# EAGLE design power supply (EAGLE 6.3)
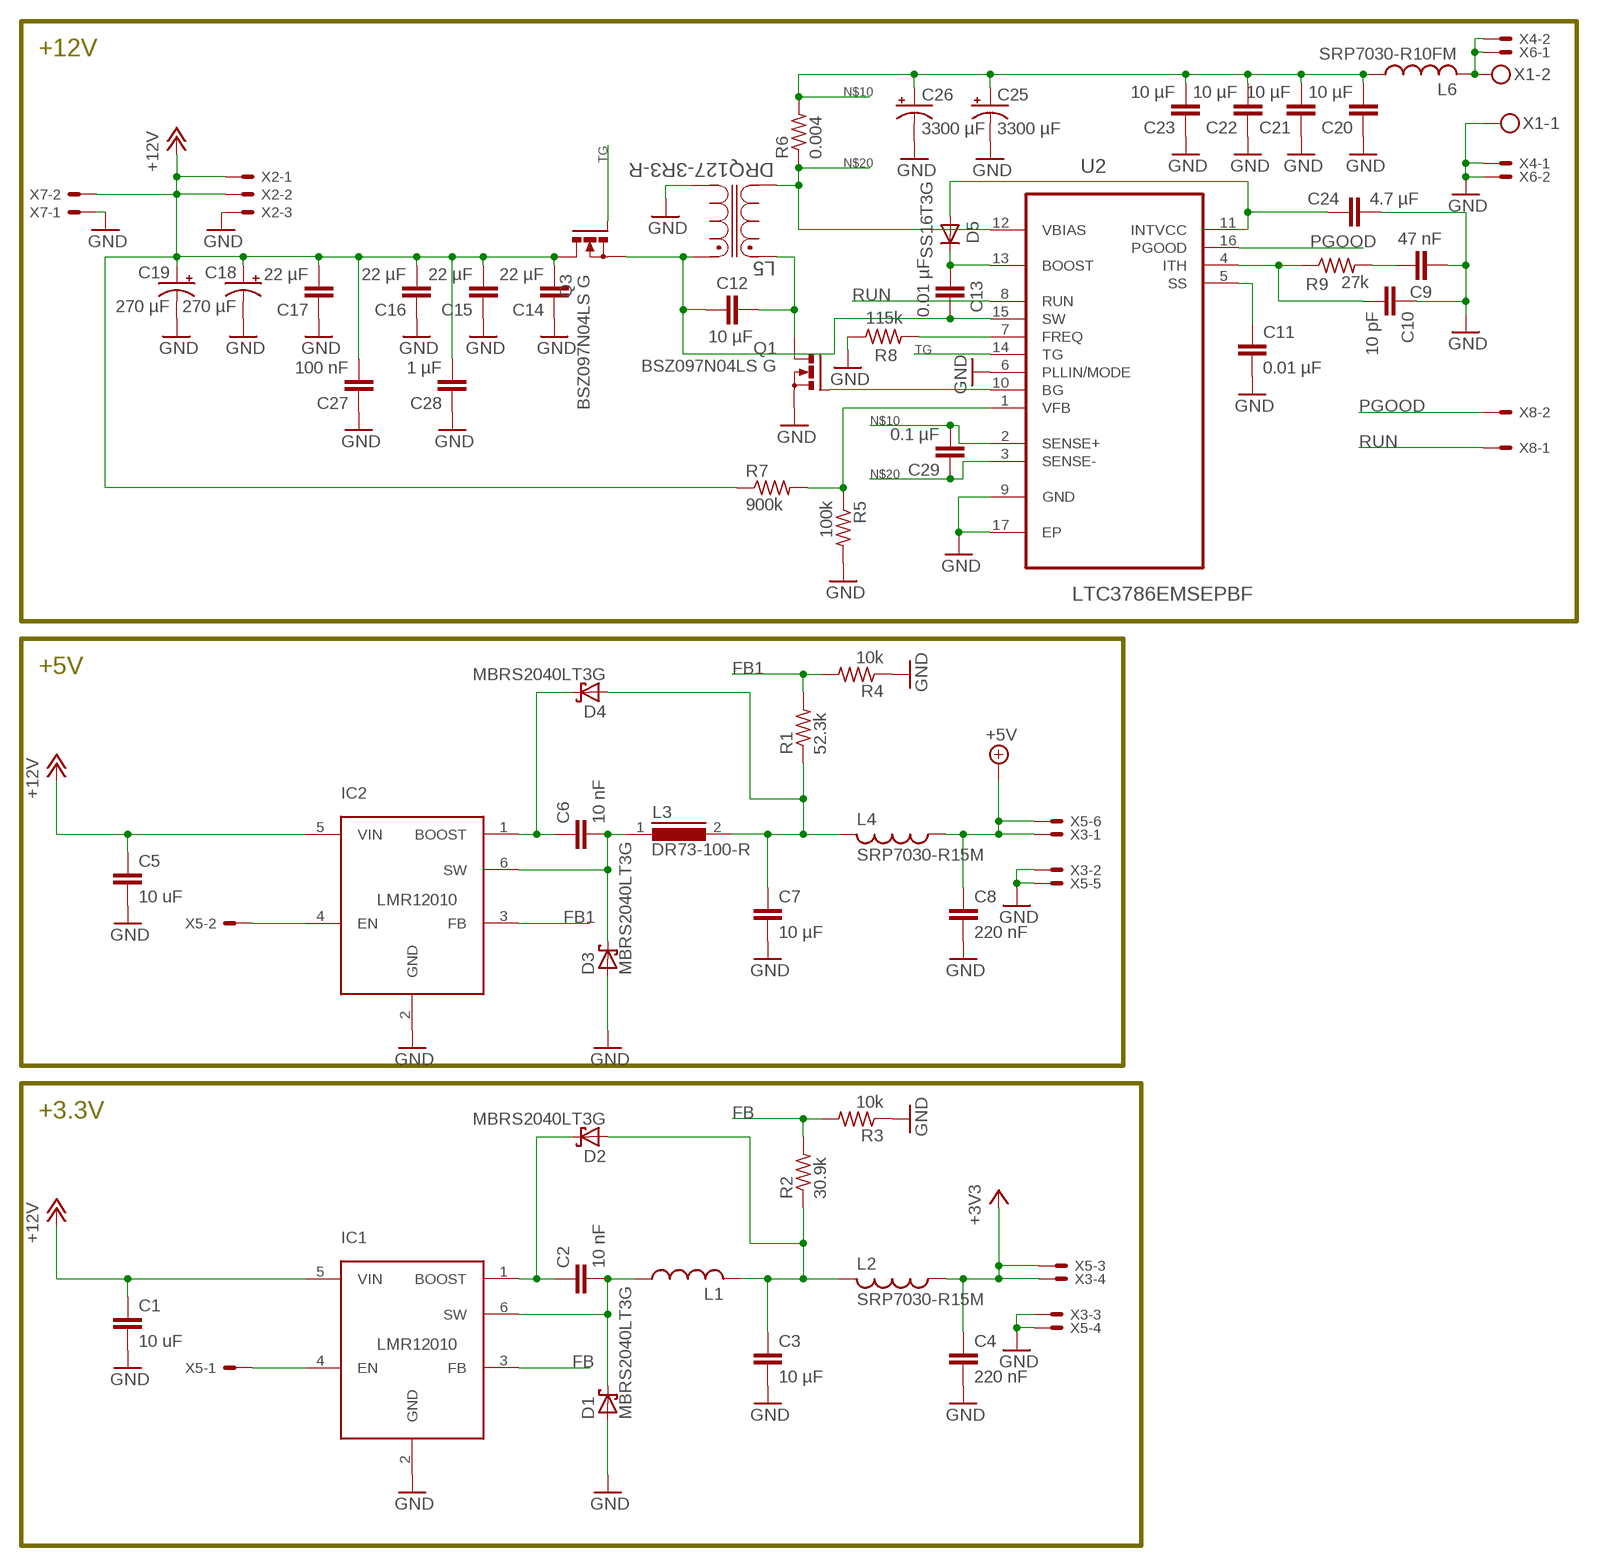
[diagram p0: schematic, sheet 1]

## Parts
C1  10 uF  C-EUC0805  [C0805]
C2  10 nF  C-EUC0805  [C0805]
C3  10 µF  C-EUC0805  [C0805]
C4  220 nF  C-EUC0805  [C0805]
C5  10 uF  C-EUC0805  [C0805]
C6  10 nF  C-EUC0805  [C0805]
C7  10 µF  C-EUC0805  [C0805]
C8  220 nF  C-EUC0805  [C0805]
C9  47 nF  C-EUC0805  [C0805]
C10  10 pF  C-EUC0805  [C0805]
C11  0.01 µF  C-EUC0805  [C0805]
C12  10 µF  C-EUC1210  [C1210]
C13  0.01 µF  C-EUC0805  [C0805]
C14  22 µF  C-EUC1210  [C1210]
C15  22 µF  C-EUC1210  [C1210]
C16  22 µF  C-EUC1210  [C1210]
C17  22 µF  C-EUC1210  [C1210]
C18  270 µF  CPOL-USE3.5-8  [E3,5-8]
C19  270 µF  CPOL-USE3.5-8  [E3,5-8]
C20  10 µF  C-EUC1210  [C1210]
C21  10 µF  C-EUC1210  [C1210]
C22  10 µF  C-EUC1210  [C1210]
C23  10 µF  C-EUC1210  [C1210]
C24  4.7 µF  C-EUC0805  [C0805]
C25  3300 µF  CPOL-USE7.5-16  [E7,5-16]
C26  3300 µF  CPOL-USE7.5-16  [E7,5-16]
C27  100 nF  C-EUC0805  [C0805]
C28  1 µF  C-EUC0805  [C0805]
C29  0.1 µF  C-EUC0805  [C0805]
D1  MBRS2040LT3G  MBRS130LT3  [SMB]
D2  MBRS2040LT3G  MBRS130LT3  [SMB]
D3  MBRS2040LT3G  MBRS130LT3  [SMB]
D4  MBRS2040LT3G  MBRS130LT3  [SMB]
D5  SS16T3G  DIODE-DO-214AC  [DO-214AC]
IC1  LMR12010  [SOT23-6L]
IC2  LMR12010  [SOT23-6L]
L1  SLF7045T-100M1R3-PF  L-USSLF7045  [SLF7045]
L2  SRP7030-R15M  L-USSRP7030  [SRP7030]
L3  DR73-100-R  DR73  [DR73]
L4  SRP7030-R15M  L-USSRP7030  [SRP7030]
L5  DRQ127-3R3-R  DRQ127-100-R  [INDM125125X800N]
L6  SRP7030-R10FM  L-USSRP7030  [SRP7030]
Q1  BSZ097N04LS G  BSZ105N04NS  [PG-TDSON-8]
Q3  BSZ097N04LS G  BSZ105N04NS  [PG-TDSON-8]
R1  52.3k  R-US_R0805  [R0805]
R2  30.9k  R-US_R0805  [R0805]
R3  10k  R-US_R0805  [R0805]
R4  10k  R-US_R0805  [R0805]
R5  100k  R-US_R0805  [R0805]
R6  0.004  R-US_R2512  [R2512]
R7  900k  R-US_R0805  [R0805]
R8  115k  R-US_R0805  [R0805]
R9  27k  R-US_R0805  [R0805]
U2  LTC3786EMSEPBF  [SOP50P690X110-17N]
X1  MKDSN1,5/2-5,08  [MKDSN1,5/2-5,08]
X2  KK-156-3  [KK-156-3]
X3  KK-156-4  [KK-156-4]
X4  KK-156-2  [KK-156-2]
X5  C-GRID-06-70543  [70543-06]
X6  C-GRID-02-70543  [70543-02]
X7  C-GRID-02-70543  [70543-02]
X8  C-GRID-02-70543  [70543-02]

## Nets
+3V3: C4.1 L2.1 X3.4 X5.3
+5V: C8.1 L4.1 X3.1 X5.6
+12V: C1.1 C5.1 C14.2 C15.2 C16.2 C17.2 C18.+ C19.+ C27.2 C28.2 IC1.5(VIN) IC2.5(VIN) Q3.5(D) Q3.6(D) Q3.7(D) Q3.8(D) Q3.TH(D) R7.1 X2.1 X2.2 X7.2
FB: IC1.3(FB) R2.2 R3.2
FB1: IC2.3(FB) R1.2 R4.2
GND: C1.2 C3.2 C4.2 C5.2 C7.2 C8.2 C9.2 C10.1 C11.2 C14.1 C15.1 C16.1 C17.1 C18.- C19.- C20.1 C21.1 C22.1 C23.1 C24.2 C25.- C26.- C27.1 C28.1 D1.A D3.A IC1.2(GND) IC2.2(GND) L5.4 Q1.1(S) Q1.2(S) Q1.3(S) R3.1 R4.1 R5.2 R8.1 U2.6(PLLIN/MODE) U2.9(GND) U2.17(EP) X1.1 X2.3 X3.2 X3.3 X4.1 X5.4 X5.5 X6.2 X7.1
N$1: IC1.4(EN) X5.1
N$2: R5.1 R7.2 U2.1(VFB)
N$3: C2.1 D2.C IC1.1(BOOST)
N$4: C2.2 D1.C IC1.6(SW) L1.1
N$5: C3.1 D2.A L1.2 L2.2 R2.1
N$6: C6.1 D4.C IC2.1(BOOST)
N$7: C6.2 D3.C IC2.6(SW) L3.1
N$8: C7.1 D4.A L3.2 L4.2 R1.1
N$9: IC2.4(EN) X5.2
N$10: C20.2 C21.2 C22.2 C23.2 C25.+ C26.+ C29.2 L6.1 R6.2 U2.2(SENSE+)
N$11: C24.1 D5.A U2.11(INTVCC)
N$12: C12.1 L5.1 Q1.5(D) Q1.6(D) Q1.7(D) Q1.8(D) Q1.TH(D)
N$14: C10.2 R9.1 U2.4(ITH)
N$15: C13.1 D5.C U2.13(BOOST)
N$16: C12.2 C13.2 L5.2 Q3.1(S) Q3.2(S) Q3.3(S) U2.15(SW)
N$17: Q1.4(G) U2.10(BG)
N$18: L6.2 X1.2 X4.2 X6.1
N$19: R8.2 U2.7(FREQ)
N$20: C29.1 L5.3 R6.1 U2.3(SENSE-) U2.12(VBIAS)
N$21: C11.1 U2.5(SS)
N$22: C9.1 R9.2
PGOOD: U2.16(PGOOD) X8.2
RUN: U2.8(RUN) X8.1
TG: Q3.4(G) U2.14(TG)

## Notes on the sheet
- +12V
- +5V
- +3.3V

## Library data of the parts
C1-C17 C20-C24 C27-C29 = rcl:C-EU: CAPACITOR, European symbol
C18 C19 C25 C26 = rcl:CPOL-US: POLARIZED CAPACITOR, American symbol
D1-D4 = diode:MBRS130LT3: Schottky Power Rectifier Source: http://www.onsemi.com/pub/Collateral/MBRS130LT3-D.PDF
D5 = diode:DIODE-: DIODE
IC1 IC2 = national-semiconductor:LMR12010
L1 = SLF7045:L-US: INDUCTOR, American symbol
L2 L4 L6 = inductors:L-US: INDUCTOR, American symbol
L3 = inductors:DR73: High Power Density, High Efficiency, Shielded Inductors Source: coiltronics_dr_series.pdf
L5 = DRQ127_farnell:DRQ127-100-R: POWER INDUCTOR; CURRENT: 3.02A; INDUCTANCE: 10.47µH; MPN: DRQ127-100-R; OC_FARNELL: 1653725; OC_NEWARK: 27K7224; PACKAGE: SMD; SUPPLIER: Coiltronics; TOLERANCE: ±20%
Q1 Q3 = transistor-power:BSZ105N04NS: OptiMOS (TM)3 Power-Transistor N-Channel, Normal level Source : Data sheet <http://www.infineon.com/dgdl/BSZ105N04NSG_rev1.1.pdf?folderId=db3a3043156fd5730115c7d50620107c&fileId=db3a30431689f4420116c485c67f084e>
R1-R9 = rcl:R-US_: RESISTOR, American symbol
U2 = LTC3786EMS_farnell:LTC3786EMSEPBF: Boost Controller; MPN: LTC3786EMSE#PBF; OC_FARNELL: 1868057; OC_NEWARK: 13T3893; PACKAGE: MSOP-16; SUPPLIER: Linear Technology
X1 = con-phoenix-508:MKDSN1,5/2-5,08: MKDSN 1,5/ 2-5,08 Printklemme Nennstrom: 13,5 A Nennspannung: 250 V Rastermaß: 5,08 mm Polzahl: 2 Anschlussart: Schraubanschluss Montage: Löten Anschlussrichtung Leiter/Platine: 0 ° Artikelnummer: 1729128 Source: http://eshop.phoenixcontact.com .. 1729128.pdf; MPN: MKDSN 1,5/2-5.08; OC_FARNELL: 1792903; OC_NEWARK: 30M2397
X2 = con-molex:KK-156-3: KK 156 HEADER Source: http://www.molex.com/pdm_docs/sd/026604100_sd.pdf; OC_FARNELL: unknown; OC_NEWARK: unknown
X3 = con-molex:KK-156-4: KK 156 HEADER Source: http://www.molex.com/pdm_docs/sd/026604100_sd.pdf; OC_FARNELL: unknown; OC_NEWARK: unknown
X4 = con-molex:KK-156-2: KK 156 HEADER Source: http://www.molex.com/pdm_docs/sd/026604100_sd.pdf; OC_FARNELL: unknown; OC_NEWARK: unknown
X5 = con-molex:C-GRID-06: CONNECTOR wire to board 2.54 mm (0.100") pitch header; OC_FARNELL: unknown; OC_NEWARK: unknown
X6-X8 = con-molex:C-GRID-02: CONNECTOR wire to board 2.54 mm (0.100") pitch header; OC_FARNELL: unknown; OC_NEWARK: unknown

## Board
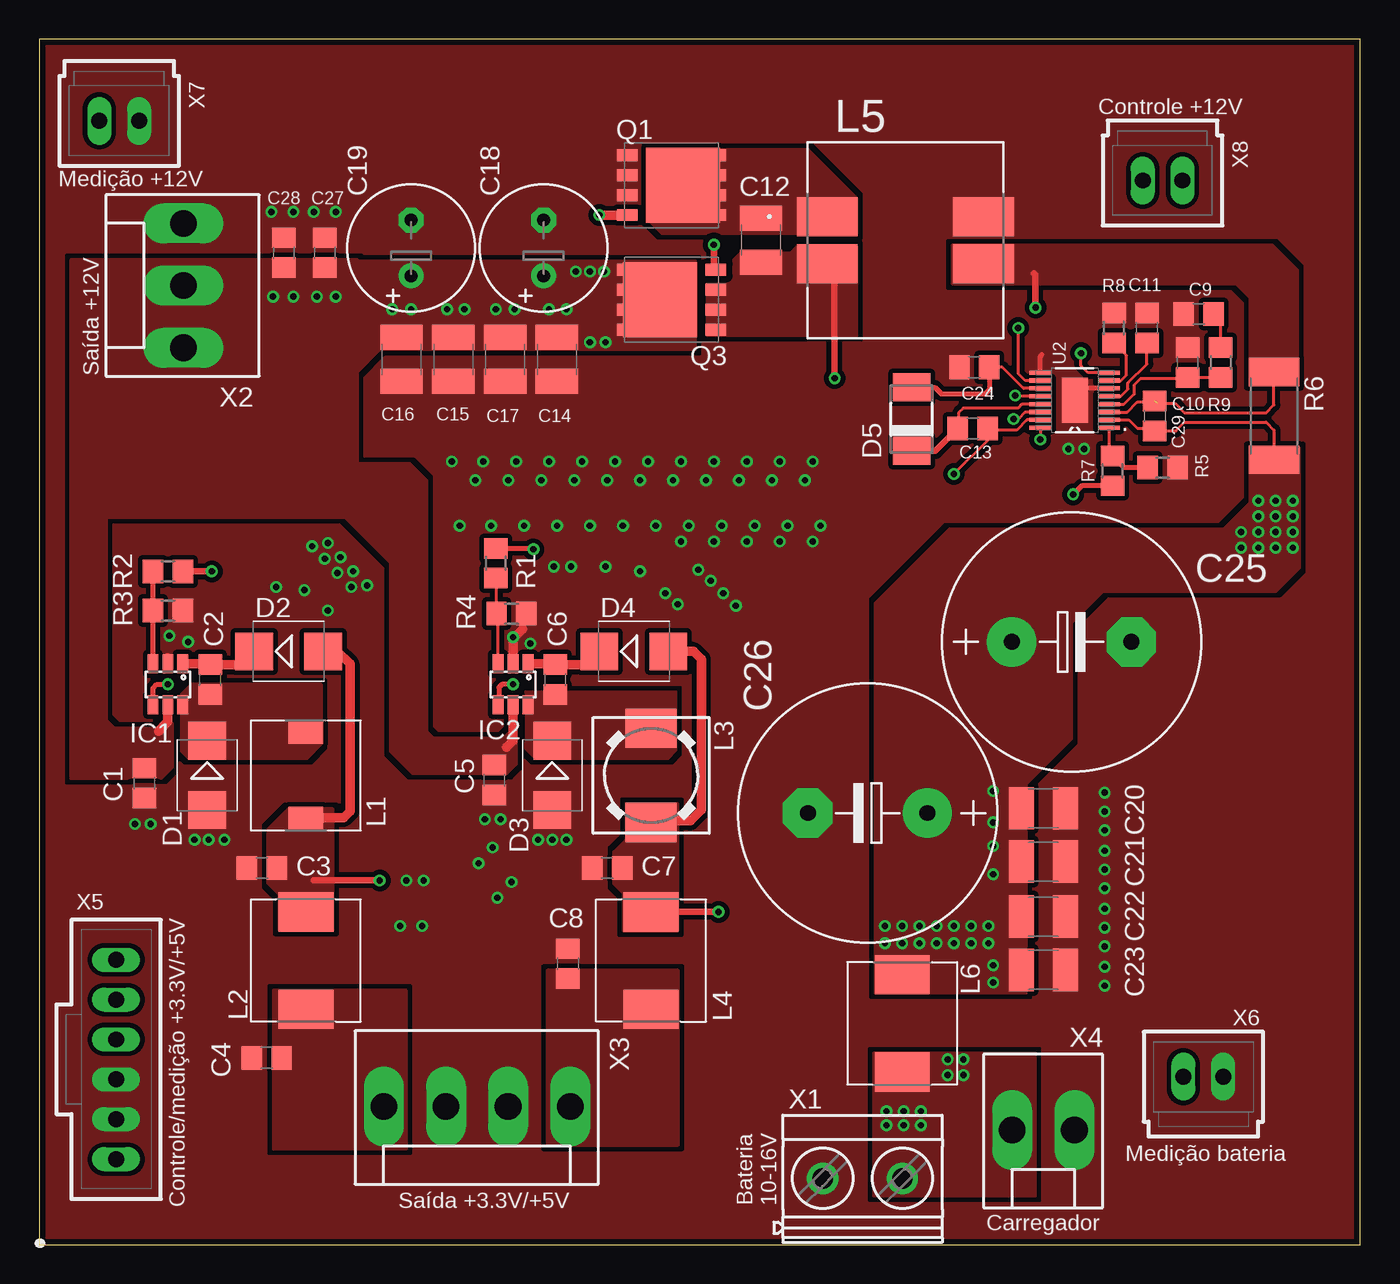
[diagram p1: board, top side]
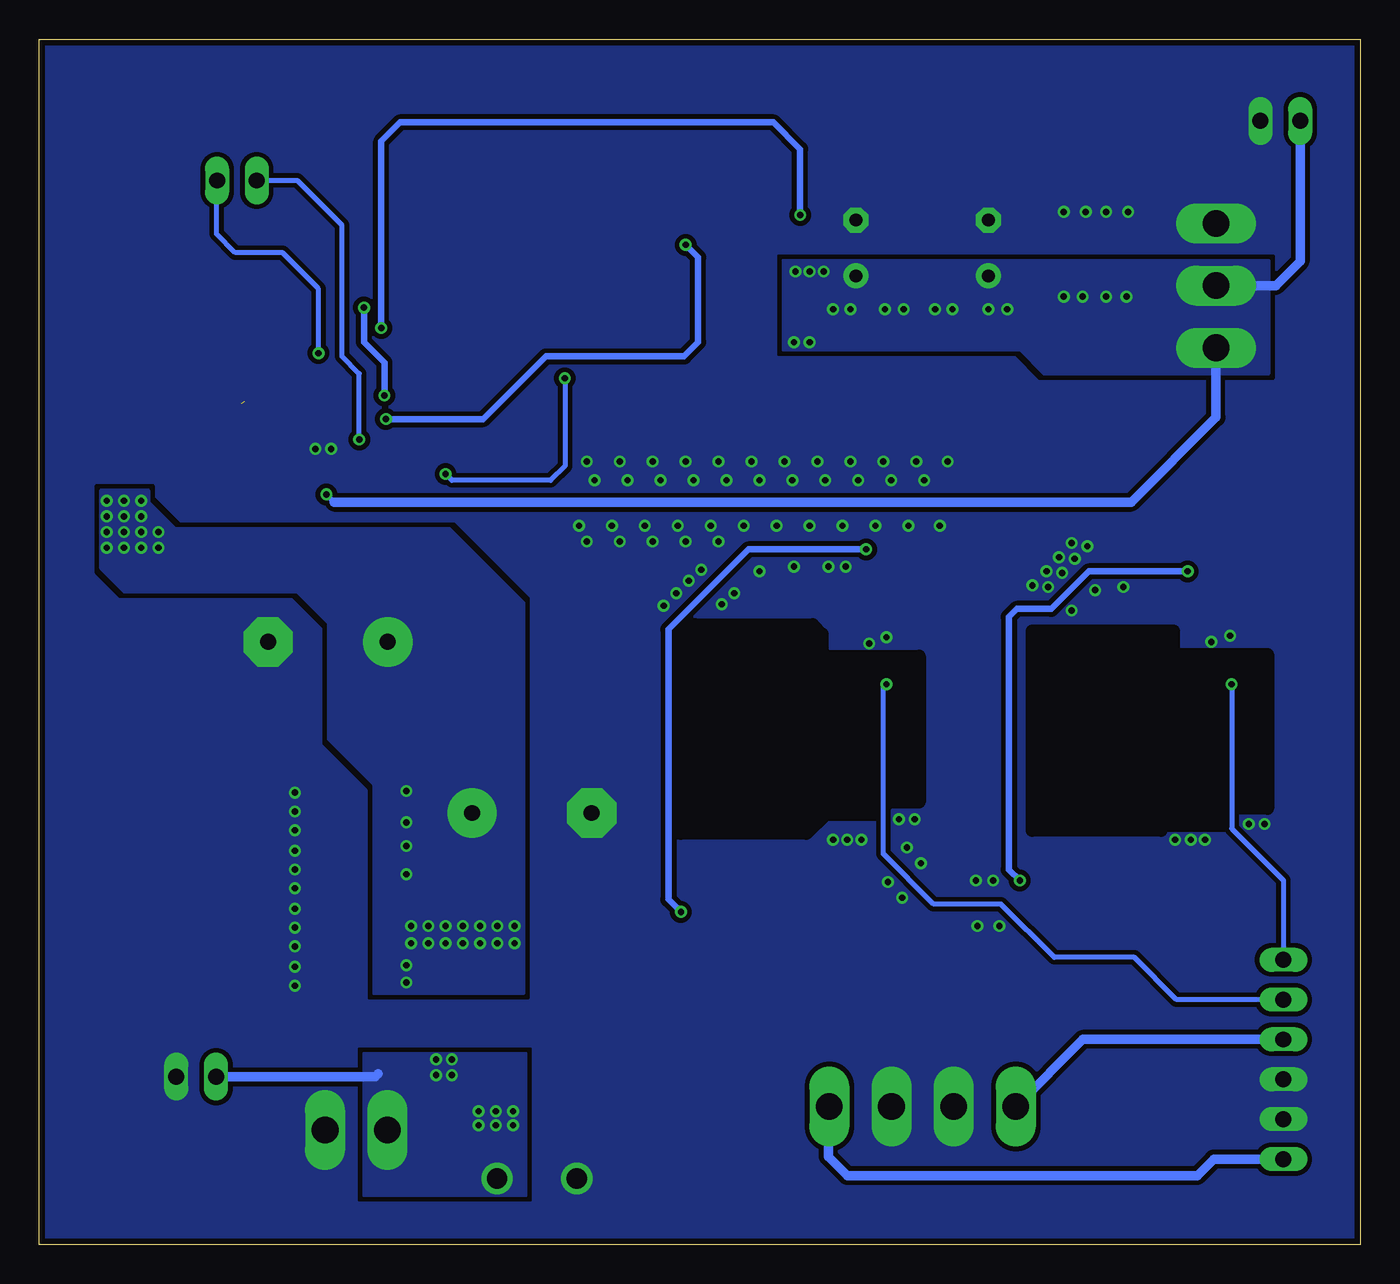
[diagram p2: board, bottom side, seen from below]

Size 84.2 x 76.8 mm. Coordinates in mm from the lower left corner, seen from the top.
Outline: 0,0 84.2,0 84.2,76.8 0,76.8 0,0
Copper layers (1*16): Top 0.0356mm / dielectric 1.5011mm / Bottom 0.0356mm
Design rules "LaenPCBOrder": minimum track width 6mil, minimum drill 13mil, track to track 6mil, track to pad 6mil, pad to pad 6mil, via to via 6mil, smd to smd 6mil, copper to edge 15mil, drill to drill 6mil, minimum pad ring 7mil, minimum via ring 7mil, stop-mask expansion 4mil, vias tented up to drill 0mil, thermal gap 10mil
bRestrict: area 28.1,26.2 to 43.3,39.5; area 5.9,26.4 to 20.9,39.1

### Footprints (pad centres in the part's own frame; a part is rotated, then mirrored left to right if it is on the bottom)
C0805 = smd 1.3 x 1.5: 1 -0.95,0; 2 0.95,0
C1210 = smd 1.6 x 2.7: 1 -1.4,0; 2 1.4,0
E3,5-8 = drill 0.813 pad 1.6: + -1.778,0 | drill 0.813 pad 1.6 octagon: - 1.778,0
E7,5-16 = drill 1.016 pad 3.15: + -3.81,0 | drill 1.016 pad 3.15 octagon: - 3.81,0
SMB = smd 2.4 x 2.4: A 2.2,0; C -2.2,0
DO-214AC = smd 1.8 x 2.4: A 2.025,0; C -2.025,0
SOT23-6L = smd 0.69 x 1.2: 1 -0.95,-1.3; 2 0,-1.3; 3 0.95,-1.3; 4 0.95,1.3; 5 0,1.3; 6 -0.95,1.3
SLF7045 = smd 1.5 x 2.2: 1 2.75,0; 2 -2.75,0
SRP7030 = smd 2.5 x 3.5: 1 -3.1,0; 2 3.1,0
DR73 = smd 2.5 x 3.25: 1 -3,0; 2 3,0
INDM125125X800N = smd 3.861 x 2.489: 1 -4.978,1.499; 2 -4.978,-1.499; 3 4.978,-1.499; 4 4.978,1.499
PG-TDSON-8 = smd 1.3 x 0.75: 1 -2.825,1.905; 2 -2.825,0.635; 3 -2.825,-0.635; 4 -2.825,-1.905; 5 2.825,-1.905; 6 2.825,-0.635; 7 2.825,0.635; 8 2.825,1.905 | smd 4.7 x 4.8: TH 0.725,0
R0805 = smd 1.3 x 1.5: 1 -0.95,0; 2 0.95,0
R2512 = smd 1.8 x 3.2: 1 -2.8,0; 2 2.8,0
SOP50P690X110-17N = smd 1.397 x 0.279: 1 -2.184,1.753; 2 -2.184,1.245; 3 -2.184,0.762; 4 -2.184,0.254; 5 -2.184,-0.254; 6 -2.184,-0.762; 7 -2.184,-1.245; 8 -2.184,-1.753; 9 2.184,-1.753; 10 2.184,-1.245; 11 2.184,-0.762; 12 2.184,-0.254; 13 2.184,0.254; 14 2.184,0.762; 15 2.184,1.245; 16 2.184,1.753 | smd 1.651 x 2.845: 17 0,0
MKDSN1,5/2-5,08 = drill 1.3 pad 2: 1 -2.561,0.025; 2 2.519,0.025
KK-156-3 = drill 1.7 pad 2.184 long: 1 -3.96,0; 2 0,0; 3 3.96,0
KK-156-4 = drill 1.7 pad 2.184 long: 1 -5.94,0; 2 -1.98,0; 3 1.98,0; 4 5.94,0
KK-156-2 = drill 1.7 pad 2.184 long: 1 -1.98,0; 2 1.98,0
70543-06 = drill 1.016 long: 1 -6.35,0; 2 -3.81,0; 3 -1.27,0; 4 1.27,0; 5 3.81,0; 6 6.35,0
70543-02 = drill 1.016 long: 1 -1.27,0; 2 1.27,0

### Placement (x,y rotation side)
C1  6.7,29.4 270 top
C2  10.9,36 270 top
C3  14.2,24 180 top
C4  14.5,11.9 180 top
C5  29,29.6 270 top
C6  32.9,36 270 top
C7  36.2,24 180 top
C8  33.7,17.9 90 top
C9  73.9,59.3 180 top
C10  73.2,56.2 270 top
C11  70.6,58.4 90 top
C12  46,64 270 top
C13  59.5,52 0 top
C14  33,56.4 90 top
C15  26.4,56.4 90 top
C16  23.1,56.4 90 top
C17  29.7,56.4 90 top
C18  32.15,63.5 90 top
C19  23.7,63.5 90 top
C20  64,27.8 180 top
C21  64,24.4 180 top
C22  64,20.9 180 top
C23  64,17.5 180 top
C24  59.6,55.9 180 top
C25  65.8,38.4 0 top
C26  52.8,27.5 180 top
C27  18.2,63.2 270 top
C28  15.6,63.2 270 top
C29  71.1,52.8 270 top
D1  10.7,29.9 270 top
D2  15.9,37.8 0 top
D3  32.7,29.9 270 top
D4  37.9,37.8 0 top
D5  55.6,52.6 90 top
IC1  8.2,35.7 180 top
IC2  30.2,35.7 180 top
L1  17,29.9 90 top
L2  17,18.1 90 top
L3  39,29.9 270 top
L4  39,18.1 90 top
L5  55.2,64 0 top
L6  55,14.1 270 top
Q1  40.3,67.5 0 top
Q3  40.3,60.2 180 top
R1  29.1,43.41 270 top
R2  8.2,42.9 180 top
R3  8.2,40.4 180 top
R4  30.1,40.2 180 top
R5  71.6,49.5 0 top
R6  78.7,52.8 270 top
R7  68.4,49.3 90 top
R8  68.5,58.4 270 top
R9  75.3,56.2 90 top
U2  66,53.8 180 top
X1  52.5,4.2 0 top
X2  9.2,61.1 90 top
X3  27.9,8.8 180 top
X4  64,7.3 180 top
X5  4.9,11.8 270 top
X6  74.2,10.7 0 top
X7  5.1,71.6 180 top
X8  71.6,67.8 180 top

### Tracks (layer width: path | path; a pad name or v marks a point on that pad's centre or on a via)
+3V3
  Bottom 0.61: X5.3 17.69,13.07 X3.4
  pour Top (isolate 0.61, no thermals): 14.9,16.2 14.9,6.1 23.4,6.1 23.4,16.2
+5V
  Bottom 0.61: X5.6 9.35,5.45 10.4,4.4 32.7,4.4 33.9,5.6 33.9,8.74 X3.1
  pour Top (isolate 0.61, no thermals): 40.7,6.3 32.4,6.3 32.4,17.5 40.7,17.5
+12V  (via drill 0.4)
  Top 0.305: R7.1 66.45,48.35 v65.9,47.8
  Top 0.61: IC1.5 8.2,33.3 7.6,32.7 | IC2.5 30.2,32.1 29.8,31.7
  Bottom 0.305: v65.9,47.8 65.4,47.3
  Bottom 0.61: X7.2 3.83,62.67 5.4,61.1 X2.2 | 65.4,47.3 14.6,47.3 9.2,52.7 X2.1
  other vias: 34.2,62 35.1,62 32.5,59.6 30.3,59.6 29.1,59.6 27.1,59.6 26,59.6 23.7,59.6 22.5,59.6 14.9,60.4 16.2,60.4 17.7,60.4 18.9,60.4 33.6,59.6 35.1,57.5 36.1,57.5 36,62
  pour Top (isolate 0.254, no thermals): 41.8,57 21.7,57 20.2,55.5 5.8,55.5 5.8,62.7 41.8,62.7
  pour Top (isolate 0.61, no thermals): 7.9,35.2 7.9,33.3 7.5,32.9 4.8,32.9 4.3,33.4 4.3,46.3 5.9,47.9 18.4,47.9 20.3,49.8 20.3,62.75 2,62.75 2,29.7 7.8,29.7 8.5,30.4 8.5,35.2
  pour Top (isolate 0.61, no thermals): 20.3,49.8 23.6,49.8 24.7,48.7 24.7,32.7 25.1,32.3 29.6,32.3 30,32.7 30,34.9 30.4,34.9 30.4,30.6 29.8,30 23.8,30 22.4,31.4 22.4,43.4 19.5,46.3 4.3,46.3 5.9,47.9 18.4,47.9
  pour Bottom (isolate 0.254, no thermals): 36.8,57 21.7,57 20.2,55.5 5.8,55.5 5.8,62.7 36.8,62.7
FB
  Top 0.305: IC1.3 R3.2 R2.2
FB1
  Top 0.203: IC2.3 29.25,40.1 R4.2 29.15,42.41 R1.2
GND  (via drill 0.4)
  Top 0.305: U2.9 63.82,56.62 63.9,56.7 | U2.6 66.76,54.56 U2.17
  Top 0.61: IC1.2 8.2,37.4 | IC2.2 30.2,38.6 30.8,39.2
  other vias: 8.3,38.8 9.5,38.4 18.2,43.7 17.4,44.5 18.4,44.7 19.2,43.8 19,42.8 19.9,41.9 20,42.9 20.9,42 31.3,38.3 30.2,38.7 65.6,50.7 66.6,50.7 23,20.3 24.4,20.3 23.4,23.2 24.5,23.2 67.9,28.8 67.9,27.6 67.9,26.4 67.9,25.1 67.9,23.9 67.9,22.7 67.9,21.4 67.9,20.2 67.9,19 67.9,17.7 67.9,16.5 27.8,48.7 32,48.7 29.9,48.7 34.1,48.7 36.2,48.7 38.3,48.7 40.4,48.7 42.5,48.7 44.6,48.7 48.8,48.7 46.7,48.7 26.8,45.8 28.8,45.8 30.9,45.8 33,45.8 35.1,45.8 37.2,45.8 39.3,45.8 41.4,45.8 43.5,45.8 45.6,45.8 47.7,45.8 49.8,45.8 40.9,44.8 43,44.8 45.1,44.8 47.2,44.8 49.3,44.8 26.3,49.9 28.3,49.9 32.5,49.9 30.4,49.9 34.6,49.9 36.7,49.9 38.8,49.9 40.9,49.9 43,49.9 45.1,49.9 49.3,49.9 47.2,49.9 18.4,40.4 16.9,41.7 15.1,41.9 6.1,26.8 7.1,26.8 9.9,25.8 10.8,25.8 11.8,25.8 28.4,27.1 29.4,27.1 31.8,25.8 32.7,25.8 33.6,25.8 32.8,43.2 33.9,43.2 36.1,43.2 38.3,42.9 39.9,41.5 40.7,40.8 42,43 42.8,42.3 43.6,41.5 44.4,40.7 29.2,22.1 30.1,23.1 28,24.3 28.9,25.3 14.8,65.8 16.2,65.8 17.5,65.8 18.9,65.8
  pour Top (isolate 0.305, rank 6, no thermals): 0,0 84.2,0 84.2,76.8 0,76.8
  pour Bottom (isolate 0.305, rank 6, no thermals): 0,0.05 84.2,0.05 84.2,76.8 0,76.8
N$1  (via drill 0.4)
  Top 0.305: IC1.4 7.25,35.45 7.5,35.7 v8.2,35.7
  Bottom 0.305: v8.2,35.7 8.2,26.5 4.9,23.2 X5.1
N$2
  Top 0.203: U2.1 68.18,50.47 R7.2 68.45,50.3
  Top 0.305: R5.1 69.15,49.5 R7.2
N$3
  Top 0.61: IC1.1 10.85,37 C2.1 12.85,36.95 D2.C
N$4
  pour Top (isolate 0.406, rank 2, no thermals): 8.9,34.9 8.9,31.6 9.5,31 17.1,31 18,31.9 18,35.7 9.7,35.7
N$5  (via drill 0.4)
  Top 0.305: 17.15,27.3 L1.2
  Top 0.406: R2.1 v11,42.9 | v21.7,23.2 17.5,23.2
  Top 0.61: D2.A 19,37.8 19.8,37 19.8,27.6 19.4,27.2 17.05,27.2 L1.2
  Bottom 0.406: v11,42.9 17.3,42.9 19.7,40.5 21.9,40.5 22.4,40 22.4,23.9 v21.7,23.2
  pour Top (isolate 0.406, no thermals): 15.3,20 15.3,22.3 14.6,23 14.6,26.5 15.9,27.8 18.7,27.8 18.7,20
N$6
  Top 0.61: IC2.1 32.85,37 C6.1 34.85,36.95 D4.C
N$7
  pour Top (isolate 0.406, rank 2, no thermals): 30.9,35.2 30.9,31.7 31.6,31 40.1,31 40.6,31.5 40.6,35.2
N$8  (via drill 0.4)
  Top 0.305: R1.1 31.44,44.36 v31.5,44.3
  Top 0.406: v43.3,21.2 L4.2
  Top 0.61: L3.2 39.1,27 41.5,27 42.2,27.7 42.2,37.3 41.7,37.8 D4.A
  Bottom 0.406: v31.5,44.3 39,44.3 44.1,39.2 44.1,22 v43.3,21.2
  pour Top (isolate 0.406, no thermals): 37.4,28.1 37.4,25.8 36.6,25 36.6,23 37.2,22.4 37.2,20 40.7,20 40.7,28.1
N$9  (via drill 0.4)
  Top 0.305: v30.2,35.7 29.5,35.7 29.3,35.5 29.3,34.45 IC2.4
  Bottom 0.305: v30.2,35.7 30.4,35.5 30.4,24.9 27.2,21.7 22.9,21.7 19.5,18.3 14.4,18.3 11.71,15.61 X5.2
N$10  (via drill 0.4)
  Top 0.203: R6.2 78.7,51.9 78.2,52.4 73,52.4 72.45,51.85 C29.2 70.95,52 70,52 69.44,52.55 U2.2
  other vias: 77.7,47.4 78.8,47.4 79.9,47.4 57.2,20.3 56.1,20.3 58.3,20.3 55,20.3 53.9,20.3 59.4,20.3 59.4,19.2 58.3,19.2 57.2,19.2 56.1,19.2 55,19.2 53.9,19.2 77.7,46.4 78.8,46.4 79.9,46.4 77.7,45.4 78.8,45.4 79.9,45.4 76.6,45.4 76.6,44.4 77.7,44.4 78.8,44.4 79.9,44.4 60.5,20.3 60.5,19.2 60.8,16.7 60.8,17.8 60.8,23.6 60.8,25.4 60.8,28.9 60.8,26.9
  pour Top (isolate 0.61, no thermals): 80.3,50.8 80.3,43.1 78.8,41.6 67.8,41.6 65.8,39.6 65.8,32.2 62.9,29.3 62.9,16 53.3,16 53.3,40.9 58,45.6 75.5,45.6 77.2,47.3 77.2,50.8
  pour Bottom (isolate 0.61, no thermals): 80.3,48.05 80.3,43.1 78.8,41.6 67.8,41.6 65.8,39.6 65.8,32.2 62.9,29.3 62.9,16 53.3,16 53.3,40.9 58,45.6 75.5,45.6 77.2,47.3 77.2,48.05
N$11
  Top 0.203: U2.11 62.74,54.56 61.4,55.9 C24.1
  Top 0.305: D5.A 57.08,54.62 57.5,54.2 60.3,54.2 60.6,54.5 60.6,55.85 C24.1
N$12
  pour Top (isolate 0.406, no thermals): 52.1,64.4 39.7,64.4 38.8,65.3 38.8,69.8 49,69.8 52.1,66.7
N$14
  Top 0.178: 69.8,54.2 69.8,54.8 70.2,55.2 73.15,55.2
  Top 0.203: C10.2 R9.1 | U2.4 69.15,53.55 69.8,54.2 | 73.05,55.1 C10.2 | 73.15,55.3 C10.2 | 72.95,55 C10.2 | 73.15,55.2 C10.2
N$15
  Top 0.203: U2.13 62.65,53.55 62.4,53.3 58.9,53.3 58.6,53 58.6,52.05 C13.1
  Top 0.406: D5.C 57.12,50.58 C13.1
N$16  (via drill 0.4)
  Top 0.203: U2.15 62.95,52.55 62.3,51.9 60.55,51.9 C13.2 60.45,51.25 v58.3,49.1
  Top 0.406: v50.7,55.2 50.7,62.02 L5.2
  Bottom 0.305: v50.7,55.2 50.7,49.6 51.6,48.7 57.9,48.7 v58.3,49.1
  pour Top (no thermals): 48.4,63.6 52,63.6 52,61.4
  pour Top (isolate 0.406, no thermals): 42.6,57.9 42.6,62.3 43.8,62.3 44.7,63.2 47.9,63.2 48.3,63.6 52.1,63.6 52.1,57.9
N$17  (via drill 0.4)
  Top 0.203: U2.10 62.85,55.05 62.4,55.5 v62.4,58.4
  Top 0.61: v35.7,65.6 Q1.4
  Bottom 0.406: v35.7,65.6 35.7,69.8 37.4,71.5 61.2,71.5 62.4,70.3 v62.4,58.4
N$18  (via drill 0.4)
  Bottom 0.61: X6.1 62.8,10.7 62.6,10.9
  other vias: 57.9,11.8 57.9,10.8 56.2,8.5 55.1,8.5 54,8.5 54,7.6 55.1,7.6 56.2,7.6 58.9,10.8 58.9,11.8
  pour Top (isolate 0.61, no thermals): 53.2,12.2 56.8,12.2 56.8,3.1 53.2,3.1
  pour Bottom (isolate 0.254, no thermals): 53.2,3.1 63.5,3.1 63.5,12.2 53.2,12.2
  pour Top (isolate 0.254, no thermals): 53.2,3.1 63.5,3.1 63.5,12.2 53.2,12.2
N$19
  Top 0.203: U2.7 68.94,55.05 69.3,55.4 69.3,56.65 R8.2
N$20  (via drill 0.4)  (1 unrouted)
  Top 0.203: U2.12 62.25,54.05 v62.2,54.1 | 71.3,53.6 72.4,53.6 73,53 78.2,53 78.7,53.5 R6.1 | U2.3 69.34,53.04 70,53.7 71.05,53.7 C29.1
  Top 0.406: v63.5,59.7 63.5,61.8 63.4,61.9
  Bottom 0.406: v62.2,54.1 62.2,56.2 63.5,57.5 v63.5,59.7
  pour Top (no thermals): 58.2,63.7 78.6,63.7 80.2,62.1 80.2,54.8 77.2,54.8 77.2,60.3 76.3,61.2 58.2,61.2
N$21
  Top 0.203: U2.5 68.95,54.05 69.4,54.5 69.4,54.9 70.6,56.1 C11.1 70.7,57.35
N$22
  Top 0.203: R9.2 75.3,58.85 C9.1
PGOOD  (via drill 0.4)
  Top 0.203: U2.16 63.82,51.32 v63.8,51.3
  Bottom 0.305: v63.8,51.3 63.8,55.5 64.9,56.6 64.9,64.94 67.76,67.8 X8.2
RUN  (via drill 0.4)
  Top 0.203: U2.8 66.85,55.55 66.4,56 v66.4,56.8
  Bottom 0.305: v66.4,56.8 66.4,60.9 68.7,63.2 71.7,63.2 72.9,64.4 72.9,67.77 X8.1
TG  (via drill 0.4)
  Top 0.203: U2.14 62.84,53.04 62.4,52.6 v62.1,52.6
  Top 0.406: v43,63.7 43,62.23 Q3.4
  Bottom 0.406: v62.1,52.6 55.9,52.6 51.9,56.6 43.1,56.6 42.2,57.5 42.2,62.9 v43,63.7

### Text on the board
tNames: Controle +12V | Medição +12V | Saída +12V | Medição bateria | Controle/medição +3.3V/+5V | Saída +3.3V/+5V | Bateria / 10-16V | Carregador